# EAGLE design GoodNightLight (EAGLE 9.6.2)
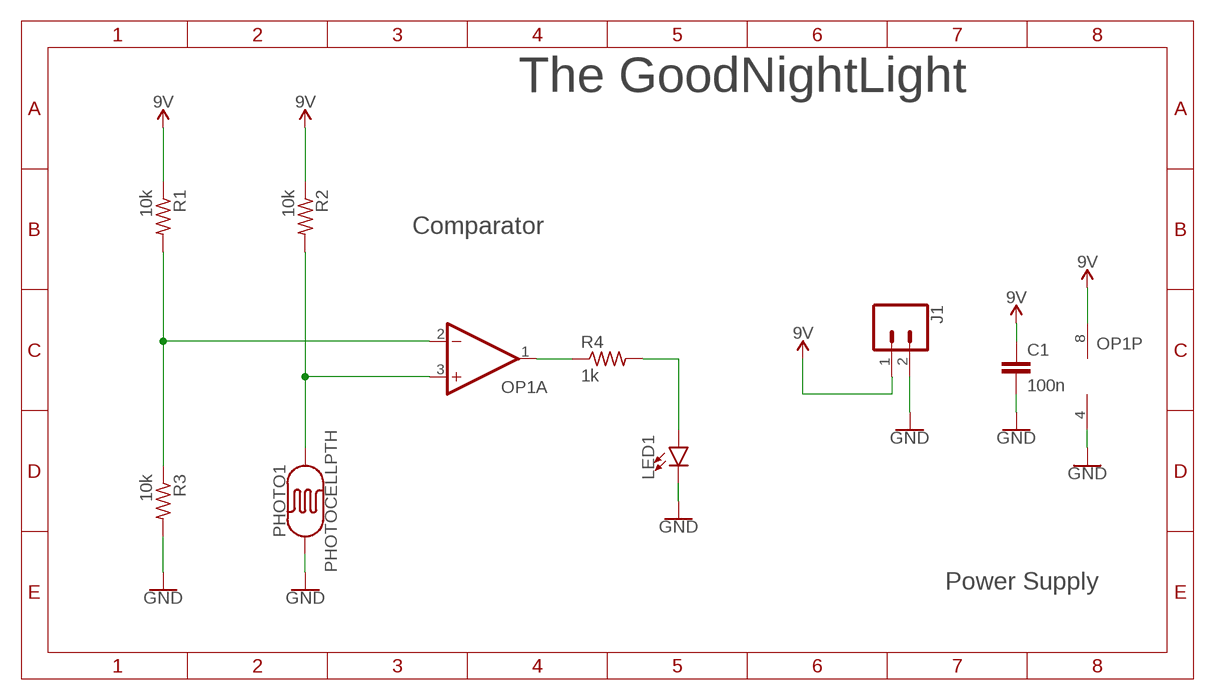
[diagram p0: schematic, sheet 1]

## Parts
C1  100n  CAPACITOR0603  [C0603]
J1  CONN_02  [1X02]
LED1  LED5MM  [LED_5MM]
OP1  OP-DUALR  [SO8]
PHOTO1  PHOTOCELLPTH  [PHOTOCELL]
R1  10k  RESISTOR0603  [R0603]
R2  10k  RESISTOR0603  [R0603]
R3  10k  RESISTOR0603  [R0603]
R4  1k  RESISTOR0603  [R0603]

## Nets
9V: C1.1 J1.1 OP1.8(P:V+) R1.1 R2.1
GND: C1.2 J1.2 LED1.K(C) OP1.4(P:V-) PHOTO1.1 R3.2
N$1: OP1.3(A:+IN) PHOTO1.2 R2.2
N$2: OP1.1(A:OUT) R4.1
N$3: OP1.2(A:-IN) R1.2 R3.1
N$4: LED1.A R4.2
Unconnected: OP1.5(B:+IN) OP1.6(B:-IN) OP1.7(B:OUT)

## Notes on the sheet
- The GoodNightLight
- Comparator
- Power Supply

## Library data of the parts
C1 = LinnesLab-Passives:CAPACITOR
J1 = LinnesLab-Connectors:CONN_02: Multi connection point. Often used as Generic Header-pin footprint for 0.1 inch spaced/style header connections On any of the 0.1 inch spaced packages, you can populate with these: Break Away Headers - Straight <https://www.sparkfun.com/products/116> (PRT-00116) Break Away Male Headers - Right Angle <https://www.sparkfun.com/products/553> (PRT-00553) Female Headers <https://www.sparkfun.com/products/115> (PRT-00115) Break Away Headers - Machine Pin <https://www.sparkfun.com/products/117> (PRT-00117) Break Away Female Headers - Swiss Machine Pin <https://www.sparkfun.com/products/743> (PRT-00743) For SCREWTERMINALS and SPRING TERMINALS visit here: Screw Terimnals on SparkFun.com <https://www.sparkfun.com/search/results?term=Screw+Terminals> (5mm/3.5mm/2.54mm spacing) This device is also useful as a general connection point to wire up your design to another part of your project. Our various solder wires solder well into these plated through hole pads. Hook-Up Wire - Assortment (Stranded, 22 AWG) <https://www.sparkfun.com/products/11375> (PRT-11375) Hook-Up Wire - Assortment (Solid Core, 22 AWG) <https://www.sparkfun.com/products/11367> (PRT-11367) View the entire wire category on our website here <https://www.sparkfun.com/categories/141> Special notes: Molex polarized connector foot print use with: PRT-08233 with associated crimp pins and housings. 2.54_SCREWTERM for use with PRT-10571. 3.5mm Screw Terminal footprints for PRT-08084 5mm Screw Terminal footprints for use with PRT-08432
LED1 = LinnesLab-LED:LED: LED (Generic) Standard schematic elements and footprints for 5mm, 3mm, 1206, and 0603 sized LEDs. Generic LEDs with no color specified. LTST-C190KGKT: arrow indicates cathode
OP1 = LinnesLab-AnalogIC:OP-DUAL: Precision Micropower, Low Noise CMOS, Rail-to-Rail Input/Output Operational Amplifiers Source: http://www.analog.com/static/imported-files/data_sheets/AD8603_8607_8609.pdf; MPN: AD8607ARMZ-R2; OC_FARNELL: 1651293; OC_NEWARK: 19M8927
PHOTO1 = LinnesLab-Sensors:PHOTOCELL: Photocell (Photodetector, Photo Resistor, CdS) This is a very small light sensor. A photocell changes (also called a photodetector, photo resistor, CdS or photoconductive cell) resistance depending on the amount of light it is exposed to. These little sensors make great ambient light triggers (when light in the room turns on, do something). Datasheet <http://cdn.sparkfun.com/datasheets/Sensors/LightImaging/SEN-09088.pdf> SparkFun Products Mini Photocell <https://www.sparkfun.com/products/9088> (SEN-09088); PROD_ID: COMP-09129; SF_ID: SEN-09088
R1-R4 = LinnesLab-Passives:RESISTOR

## Board
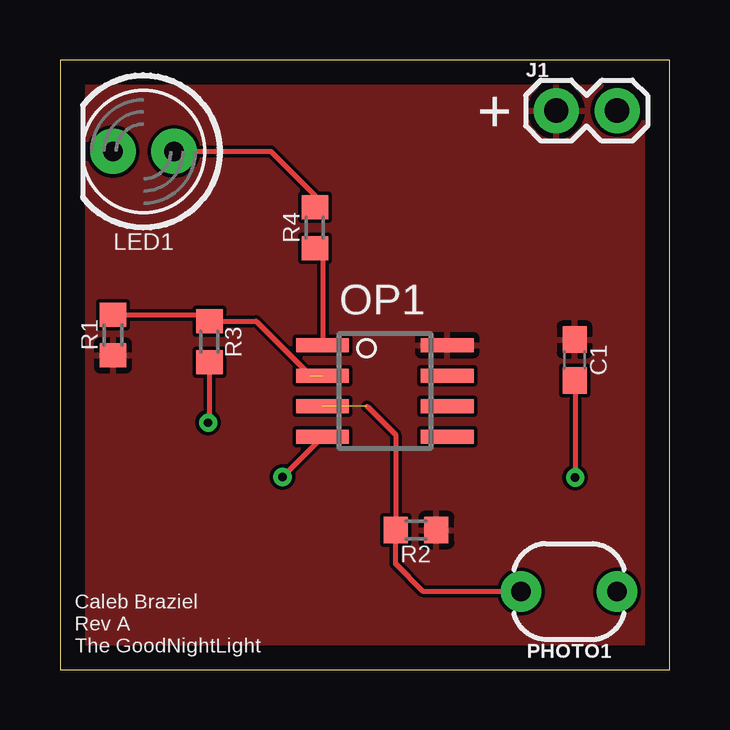
[diagram p1: board, top side]
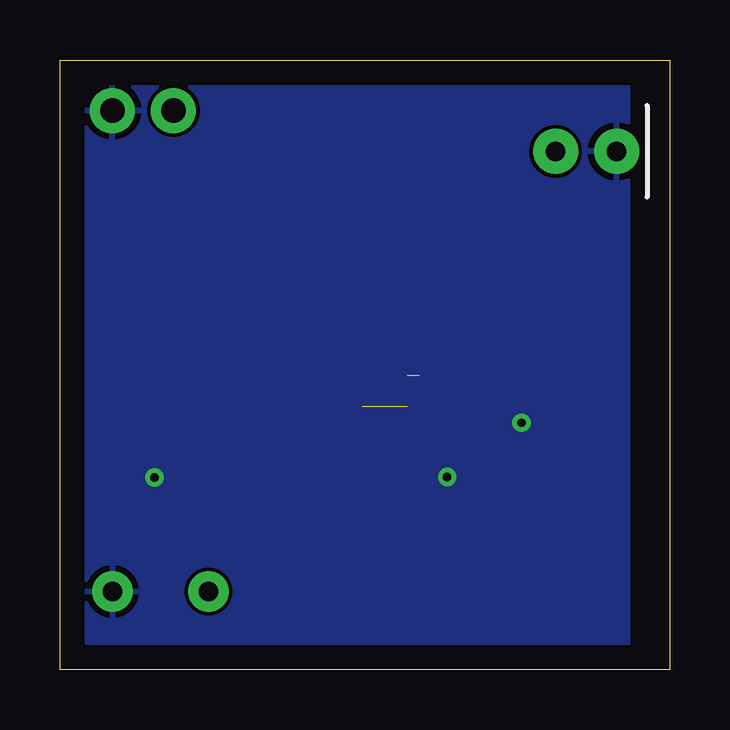
[diagram p2: board, bottom side, seen from below]

Size 25.4 x 25.4 mm. Coordinates in mm from the lower left corner, seen from the top.
Outline: 0,0 25.4,0 25.4,25.4 0,25.4 0,0
Copper layers (1*16): Top 0.035mm / dielectric 1.5mm / Bottom 0.035mm
Design rules "default": minimum track width 6mil, minimum drill 0.35mm, track to track 6mil, track to pad 6mil, pad to pad 6mil, via to via 6mil, smd to smd 6mil, copper to edge 40mil, drill to drill 6mil, minimum pad ring 10mil, minimum via ring 8mil, stop-mask expansion 4mil, vias tented up to drill 0mil, thermal gap 10mil

### Footprints (pad centres in the part's own frame; a part is rotated, then mirrored left to right if it is on the bottom)
C0603 = smd 1.1 x 1: 1 -0.85,0; 2 0.85,0
1X02 = drill 1.016 pad 1.88: 1 0,0; 2 2.54,0
LED_5MM = drill 0.813 pad 1.88: A -1.27,0; K 1.27,0
SO8 = smd 0.6 x 2.2: 1 -1.905,-2.6; 2 -0.635,-2.6; 3 0.635,-2.6; 4 1.905,-2.6; 5 1.905,2.6; 6 0.635,2.6; 7 -0.635,2.6; 8 -1.905,2.6
PHOTOCELL = drill 0.8 pad 1.676: 1 -2,0; 2 2,0
R0603 = smd 1 x 1.1: 1 -0.85,0; 2 0.85,0

### Placement (x,y rotation side)
C1  21.44,12.9 270 top
J1  20.68,23.29 0 top
LED1  3.48,21.59 180 top
OP1  13.54,11.61 270 top
PHOTO1  21.21,3.25 180 top
R1  2.21,13.94 90 top
R2  14.83,5.82 180 top
R3  6.22,13.67 270 top
R4  10.62,18.41 90 top

### Tracks (layer width: path | path; a pad name or v marks a point on that pad's centre or on a via)
9V
  pour Top: 0.15,25.25 25.43,25.25 25.43,25.22 25.43,0.1 25.32,0.1 0.15,0.1 0.15,0.84 0.15,25.22
GND  (via drill 0.35)
  Top 0.203: R3.2 6.22,10.34 v6.17,10.29 | OP1.4 v9.27,8.04 v9.27,8.03 | C1.2 21.46,12.03 v21.46,8
  pour Bottom: 25.15,25.1 25.15,24.99 25.15,0.3 1.73,0.48 1.73,24.92 1.7,24.92
N$1  (1 unrouted)
  Top 0.203: 12.8,10.97 13.98,9.79 R2.2 13.98,4.41 15.14,3.25 PHOTO1.2
N$2
  Top 0.203: R4.1 10.94,17.24 OP1.1
N$3  (1 unrouted)
  Top 0.203: R1.2 5.94,14.79 R3.1 8.17,14.52 10.44,12.24
N$4
  Top 0.203: LED1.A 8.79,21.59 10.62,19.76 R4.2

### Text on the board
tPlace: + | Caleb Braziel / Rev A / The GoodNightLight